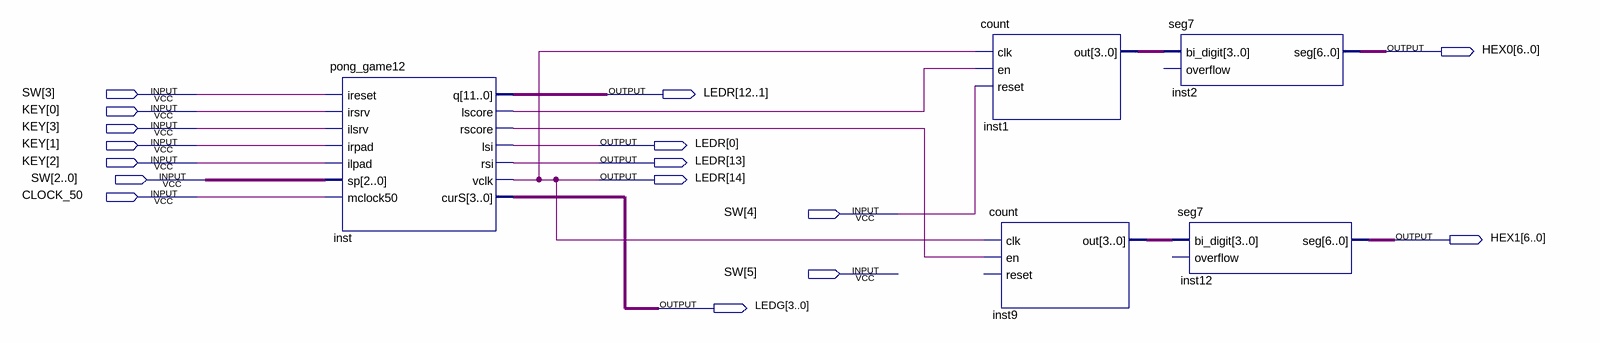
[diagram p0: schematic sheet]
// Quartus schematic lab9.bdf as structural Verilog: 5 symbols, 16 pins
module lab9 (
  input  [5:0] SW,
  input  [3:0] KEY,
  input  CLOCK_50,
  output [6:0] HEX0,
  output [14:0] LEDR,
  output [6:0] HEX1,
  output [3:0] LEDG
);

  wire inst_lscore, inst_rscore;
  wire [3:0] inst1_out, inst9_out;

  pong_game12 inst (
    .ireset(SW[3]), .irsrv(KEY[0]), .ilsrv(KEY[3]), .irpad(KEY[1]), .ilpad(KEY[2]), .sp(SW[2:0]),
    .mclock50(CLOCK_50), .q(LEDR[12:1]), .lscore(inst_lscore), .rscore(inst_rscore), .lsi(LEDR[0]),
    .rsi(LEDR[13]), .vclk(LEDR[14]), .curS(LEDG));
  count inst1 (.clk(LEDR[14]), .en(inst_lscore), .reset(SW[4]), .out(inst1_out));
  count inst9 (.clk(LEDR[14]), .en(inst_rscore), .out(inst9_out));  // open: reset
  seg7 inst2 (.bi_digit(inst1_out), .seg(HEX0));  // open: overflow
  seg7 inst12 (.bi_digit(inst9_out), .seg(HEX1));  // open: overflow
endmodule
